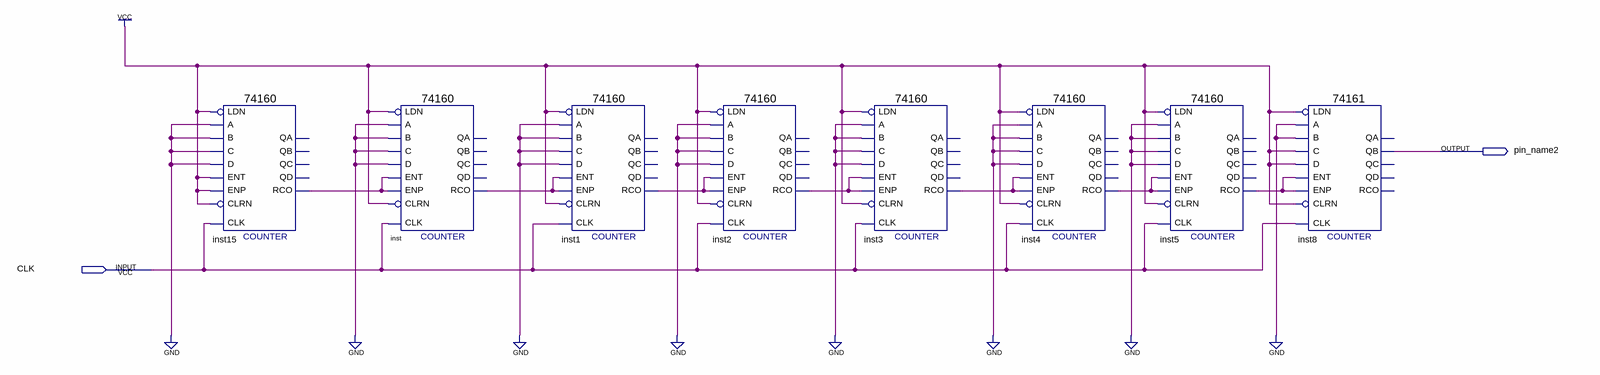
[diagram p0: schematic sheet]
// Quartus schematic ClockTime.bdf as structural Verilog: 8 symbols, 2 pins
module ClockTime (
  input  CLK,
  output pin_name2
);

  wire inst1_rco, inst2_rco, inst3_rco, inst4_rco, inst5_rco, inst15_rco, inst_rco;

  \74160  inst15 (
    .CLK(CLK), .ENT(1'b1), .A(1'b0), .B(1'b0), .C(1'b0), .D(1'b0), .LDN(1'b1), .ENP(1'b1), .CLRN(1'b1),
    .RCO(inst15_rco));  // open: QD, QA, QB, QC
  \74160  inst (
    .CLK(CLK), .ENT(inst15_rco), .A(1'b0), .B(1'b0), .C(1'b0), .D(1'b0), .LDN(1'b1), .ENP(inst15_rco),
    .CLRN(1'b1), .RCO(inst_rco));  // open: QD, QA, QB, QC
  \74160  inst1 (
    .CLK(CLK), .ENT(inst_rco), .A(1'b0), .B(1'b0), .C(1'b0), .D(1'b0), .LDN(1'b1), .ENP(inst_rco),
    .CLRN(1'b1), .RCO(inst1_rco));  // open: QD, QA, QB, QC
  \74160  inst2 (
    .CLK(CLK), .ENT(inst1_rco), .A(1'b0), .B(1'b0), .C(1'b0), .D(1'b0), .LDN(1'b1), .ENP(inst1_rco),
    .CLRN(1'b1), .RCO(inst2_rco));  // open: QD, QA, QB, QC
  \74160  inst3 (
    .CLK(CLK), .ENT(inst2_rco), .A(1'b0), .B(1'b0), .C(1'b0), .D(1'b0), .LDN(1'b1), .ENP(inst2_rco),
    .CLRN(1'b1), .RCO(inst3_rco));  // open: QD, QA, QB, QC
  \74160  inst4 (
    .CLK(CLK), .ENT(inst3_rco), .A(1'b0), .B(1'b0), .C(1'b0), .D(1'b0), .LDN(1'b1), .ENP(inst3_rco),
    .CLRN(1'b1), .RCO(inst4_rco));  // open: QD, QA, QB, QC
  \74160  inst5 (
    .CLK(CLK), .ENT(inst4_rco), .A(1'b0), .B(1'b0), .C(1'b0), .D(1'b0), .LDN(1'b1), .ENP(inst4_rco),
    .CLRN(1'b1), .RCO(inst5_rco));  // open: QD, QA, QB, QC
  \74161  inst8 (
    .CLRN(1'b1), .CLK(CLK), .ENP(inst5_rco), .LDN(1'b1), .A(1'b0), .D(1'b1), .ENT(inst5_rco), .B(1'b0),
    .C(1'b1), .QB(pin_name2));  // open: QD, QC, QA, RCO
endmodule
